# EAGLE design Joy2PS2_rev2 (EAGLE 7.6.0)
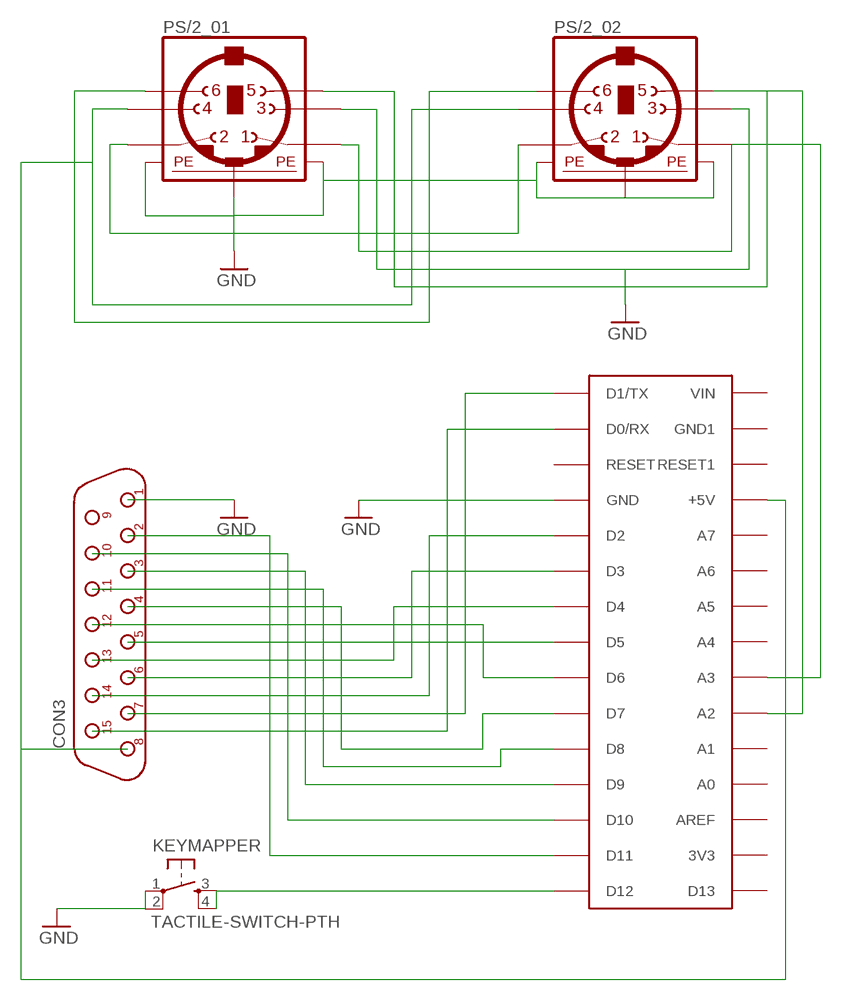
[diagram p0: schematic, sheet 1]

## Parts
ARDUINONANO  ARDUINONANO  [PDIP-32]
CON3  DB15M/90  [D-15M/90]
KEYMAPPER  TACTILE-SWITCH-PTH  [TAC-SWITCH-PTH]
PS/2_01  MINI_DIN_6  [M_DIN6]
PS/2_02  MINI_DIN_6  [M_DIN6]

## Nets
GND: ARDUINONANO.GND CON3.1 KEYMAPPER.1 KEYMAPPER.2 PS/2_01.3 PS/2_01.SH1(PE1) PS/2_01.SH2(PE2) PS/2_01.SH3(PE3) PS/2_02.3 PS/2_02.SH1(PE1) PS/2_02.SH2(PE2) PS/2_02.SH3(PE3)
N$1: ARDUINONANO.A3 PS/2_01.1 PS/2_02.1
N$2: PS/2_01.2 PS/2_02.2
N$3: ARDUINONANO.+5V CON3.8 PS/2_01.4 PS/2_02.4
N$5: ARDUINONANO.A2 PS/2_01.5 PS/2_02.5
N$6: ARDUINONANO.D10 CON3.10
N$7: ARDUINONANO.D8 CON3.11
N$8: ARDUINONANO.D0/RX CON3.15
N$9: ARDUINONANO.D1/TX CON3.7
N$10: ARDUINONANO.D2 CON3.14
N$11: ARDUINONANO.D3 CON3.6
N$12: ARDUINONANO.D4 CON3.13
N$13: ARDUINONANO.D5 CON3.5
N$14: ARDUINONANO.D6 CON3.12
N$15: ARDUINONANO.D7 CON3.4
N$16: ARDUINONANO.D9 CON3.3
N$17: ARDUINONANO.D11 CON3.2
N$19: ARDUINONANO.D12 KEYMAPPER.3 KEYMAPPER.4
N$20: PS/2_01.6 PS/2_02.6
Unconnected: ARDUINONANO.3V3 ARDUINONANO.A0 ARDUINONANO.A1 ARDUINONANO.A4 ARDUINONANO.A5 ARDUINONANO.A6 ARDUINONANO.A7 ARDUINONANO.AREF ARDUINONANO.D13 ARDUINONANO.GND1 ARDUINONANO.RESET ARDUINONANO.RESET1 ARDUINONANO.VIN CON3.9

## Library data of the parts
ARDUINONANO = jet-lib2:ARDUINONANO
CON3 = connect:DB15M/90
KEYMAPPER = GeekAmmo:TACTILE-SWITCH: Tactile Switch 4 Pins, SPST NO
PS/2_01 PS/2_02 = mini_din:MINI_DIN_6

## Board
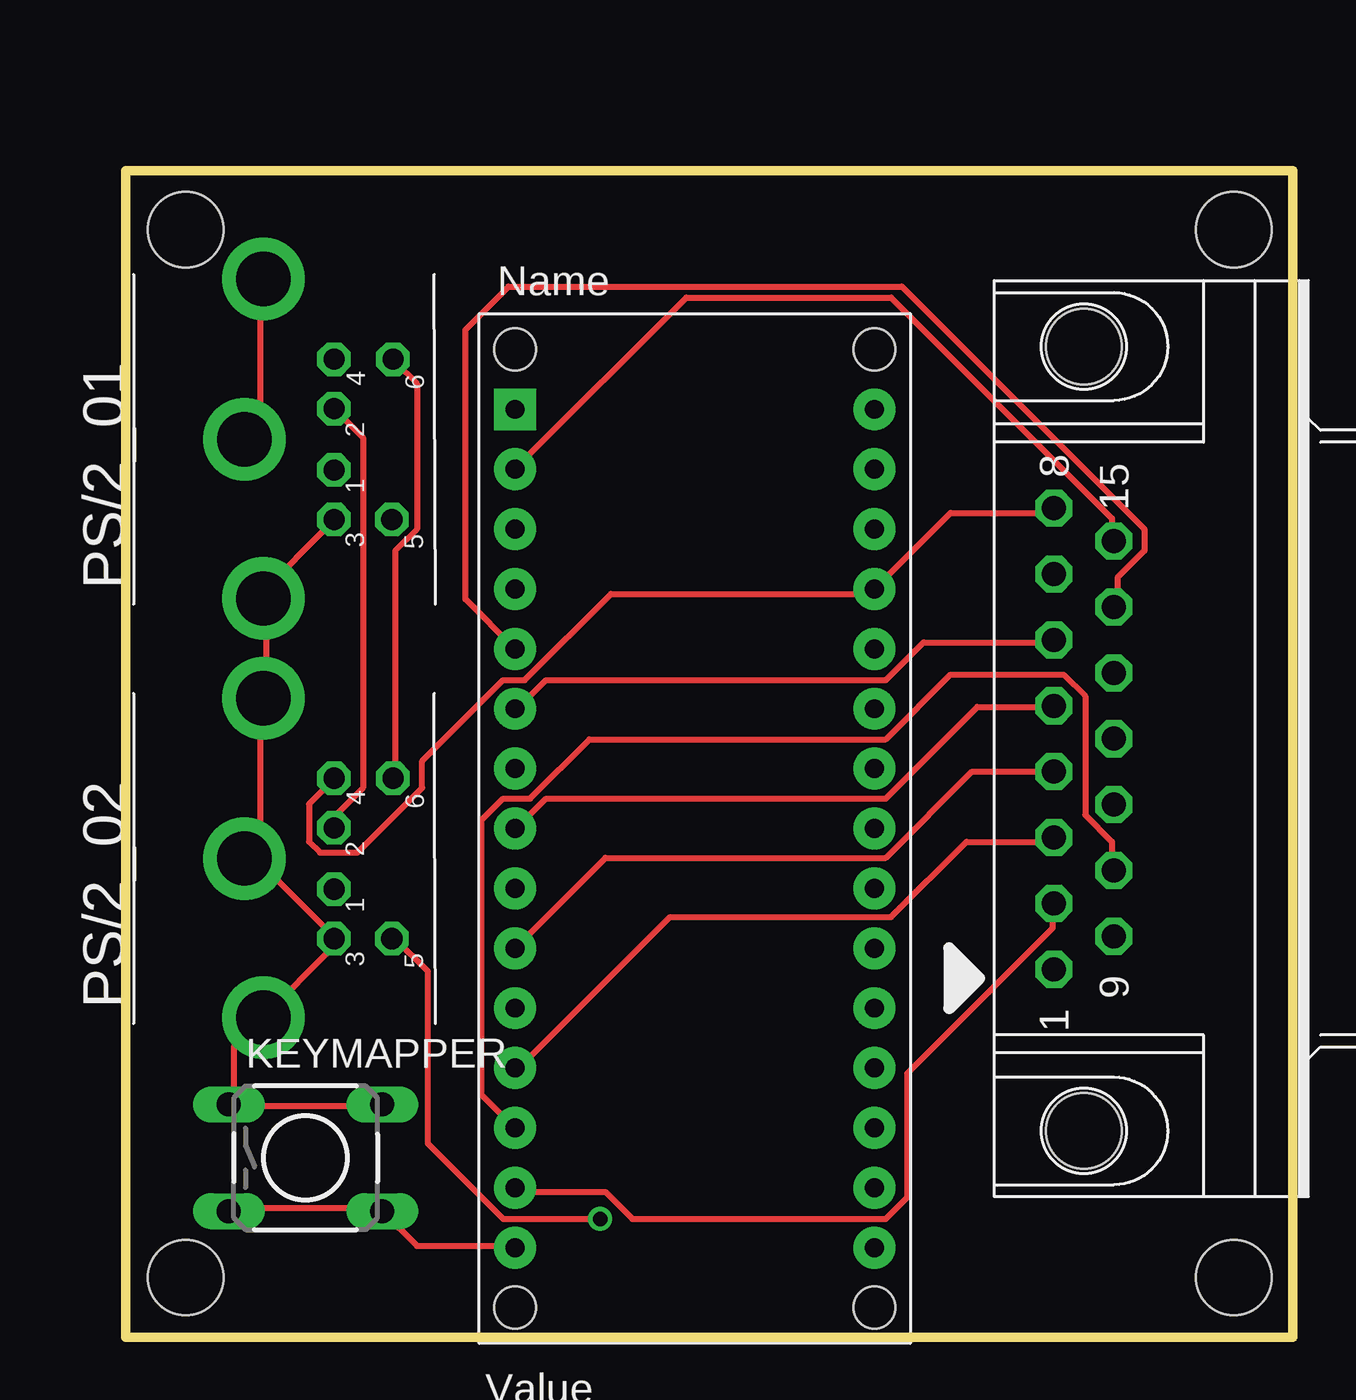
[diagram p1: board, top side]
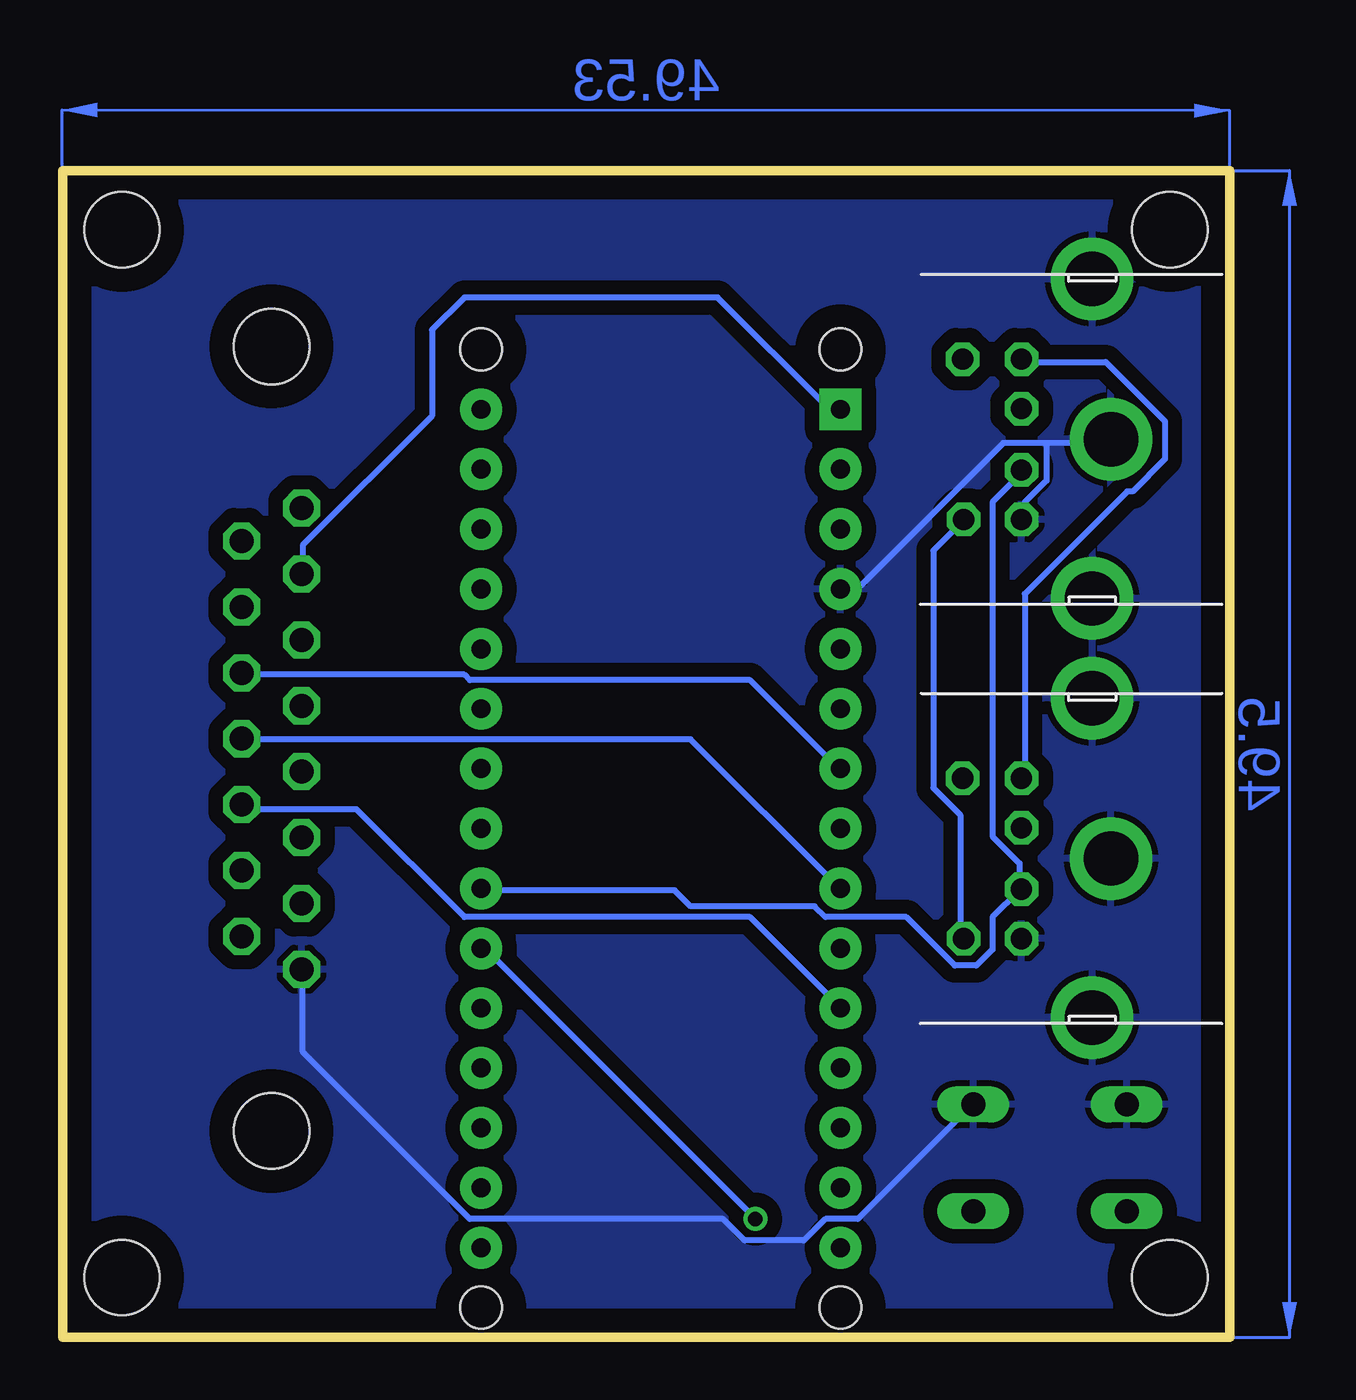
[diagram p2: board, bottom side, seen from below]

Size 49.5 x 49.5 mm. Coordinates in mm from the lower left corner, seen from the top.
Outline: 0,0 49.5,0 49.5,49.5 0,49.5 0,0
Copper layers (1*16): Top 0.035mm / dielectric 1.5mm / Bottom 0.035mm
Design rules "default": minimum track width 10mil, minimum drill 24mil, track to track 8mil, track to pad 8mil, pad to pad 8mil, via to via 8mil, smd to smd 8mil, copper to edge 40mil, drill to drill 8mil, minimum pad ring 10mil, minimum via ring 8mil, stop-mask expansion 4mil, vias tented up to drill 0mil, thermal gap 10mil
Holes 3.2 mm at 46.99,46.99 46.99,2.54 2.54,46.99 2.54,2.54

### Footprints (pad centres in the part's own frame; a part is rotated, then mirrored left to right if it is on the bottom)
PDIP-32 = drill 0.8 pad 1.778: 3V3 15.24,-35.56; +5V 15.24,-10.16; A0 15.24,-30.48; A1 15.24,-27.94; A2 15.24,-25.4; A3 15.24,-22.86; A4 15.24,-20.32; A5 15.24,-17.78; A6 15.24,-15.24; A7 15.24,-12.7; AREF 15.24,-33.02; D0/RX 0,-5.08; D2 0,-12.7; D3 0,-15.24; D4 0,-17.78; D5 0,-20.32; D6 0,-22.86; D7 0,-25.4; D8 0,-27.94; D9 0,-30.48; D10 0,-33.02; D11 0,-35.56; D12 0,-38.1; D13 15.24,-38.1; GND 0,-10.16; GND1 15.24,-5.08; RESET 0,-7.62; RESET1 15.24,-7.62; VIN 15.24,-2.54 | drill 0.8 pad 1.778 square: D1/TX 0,-2.54 | hole 1.778: 0,0; 0,-40.64; 15.24,-40.64; 15.24,0
D-15M/90 = drill 1.016 pad 1.575 octagon: 1 9.779,-1.27; 2 6.985,-1.27; 3 4.191,-1.27; 4 1.397,-1.27; 5 -1.397,-1.27; 6 -4.191,-1.27; 7 -6.985,-1.27; 8 -9.779,-1.27; 9 8.382,1.27; 10 5.588,1.27; 11 2.794,1.27; 12 0,1.27; 13 -2.794,1.27; 14 -5.588,1.27; 15 -8.382,1.27 | hole 3.2: 16.637,0; -16.637,0
TAC-SWITCH-PTH = drill 1.016 pad 1.524 long: 1 -3.251,2.261; 2 3.251,2.261; 3 -3.251,-2.261; 4 3.251,-2.261
M_DIN6 = drill 0.9 pad 1.422 octagon: 1 -1.3,-3.75; 2 1.3,-3.75; 3 -3.4,-3.75; 4 3.4,-3.75; 5 -3.4,-6.2; 6 3.4,-6.25 | drill 2.3 pad 3.5: SH1 6.8,-0.75; SH2 0,0.05; SH3 -6.75,-0.75

### Placement (x,y rotation side)
ARDUINONANO  16.51,41.91 0 top
CON3  40.64,25.4 270 top
KEYMAPPER  7.62,7.62 0 top
PS/2_01  5.08,38.1 90 top
PS/2_02  5.08,20.32 90 top

### Tracks (layer width: path | path; a pad name or v marks a point on that pad's centre or on a via)
GND
  Top 0.254: PS/2_01.3 8.69,34.52 5.71,31.55 PS/2_01.SH3 5.94,31.32 5.94,27.2 PS/2_02.SH1 5.71,26.98 5.71,20.12 | PS/2_01.SH1 5.71,44.81 5.71,38.63 5.26,38.18 PS/2_01.SH2 | KEYMAPPER.2 10.74,9.83 4.57,9.83 KEYMAPPER.1 4.57,10.06 4.57,12.34 5.71,13.49 PS/2_02.SH3 5.94,13.72 8.69,16.46 8.69,16.92 PS/2_02.3 8.69,17.14 5.71,20.12 | 5.71,20.12 5.26,20.12 PS/2_02.SH2 5.71,20.12
  Bottom 0.254: 7.77,37.95 5.26,37.95 PS/2_01.SH2 | 7.77,37.95 9.6,37.95 15.77,31.77 16.46,31.77 ARDUINONANO.GND | 7.77,37.95 7.77,36.35 8.69,35.43 8.69,34.75 PS/2_01.3 | CON3.1 39.32,15.54 39.32,12.12 32.23,5.03 21.49,5.03 20.57,4.12 18.06,4.12 17.14,5.03 15.77,5.03 10.97,9.83 KEYMAPPER.2
  pour Bottom (isolate 0.61): 0,49.53 49.53,49.53 49.53,0 0,0
N$1
  Bottom 0.254: PS/2_01.1 8.91,36.58 10.06,35.43 10.06,21.26 8.91,20.12 8.91,19.2 PS/2_02.1 8.91,18.97 10.06,17.83 10.06,16.46 10.74,15.77 11.66,15.77 13.72,17.83 17.14,17.83 17.6,18.29 22.86,18.29 23.55,18.97 31.55,18.97 ARDUINONANO.A3
N$2
  Top 0.254: PS/2_02.2 8.91,21.72 8.91,22.17 10.06,23.32 10.06,38.18 8.91,39.32 PS/2_01.2
N$3
  Top 0.254: CON3.8 39.32,34.98 34.98,34.98 ARDUINONANO.+5V 31.55,31.55 20.57,31.55 16.92,27.89 16,27.89 12.57,24.46 12.57,23.32 9.83,20.57 8.23,20.57 7.77,21.03 7.77,22.63 8.69,23.55 PS/2_02.4
  Bottom 0.254: PS/2_02.4 8.69,23.77 8.69,31.55 4.34,35.89 4.12,35.89 2.74,37.26 2.74,38.86 5.26,41.38 8.69,41.38 PS/2_01.4
N$5  (via drill 0.61)
  Top 0.254: v20.12,5.03 16,5.03 12.8,8.23 12.8,15.54 11.43,16.92 PS/2_02.5
  Bottom 0.254: PS/2_02.5 11.43,17.14 11.43,22.17 12.57,23.32 12.57,33.38 11.43,34.52 PS/2_01.5 | v20.12,5.03 31.55,16.46 ARDUINONANO.A2
N$6
  Top 0.254: CON3.10 41.83,19.89 41.83,21.03 40.69,22.17 40.69,27.2 39.78,28.12 34.98,28.12 32.23,25.38 19.66,25.38 17.14,22.86 16,22.86 15.09,21.95 15.09,10.29 16.46,8.91 ARDUINONANO.D10
N$7
  Bottom 0.254: CON3.11 41.83,22.4 37.03,22.4 32.46,17.83 20.34,17.83 16.69,14.17 ARDUINONANO.D8
N$8
  Top 0.254: CON3.15 41.83,33.83 41.83,34.75 32.46,44.12 23.77,44.12 16.69,37.03 ARDUINONANO.D0/RX
N$9
  Bottom 0.254: CON3.7 39.32,32.46 39.32,33.6 33.83,39.09 33.83,42.75 32.46,44.12 21.72,44.12 17.14,39.55 16.69,39.55 ARDUINONANO.D1/TX
N$10
  Top 0.254: ARDUINONANO.D2 14.4,31.32 14.4,42.75 16.23,44.58 32.92,44.58 43.2,34.29 43.2,33.38 42.06,32.23 42.06,31.09 CON3.14
N$11
  Top 0.254: CON3.6 39.32,29.49 33.83,29.49 32.23,27.89 17.83,27.89 16.69,26.75 ARDUINONANO.D3
N$12
  Bottom 0.254: CON3.13 41.83,28.12 32.46,28.12 32.23,27.89 20.34,27.89 16.69,24.23 ARDUINONANO.D4
N$13
  Top 0.254: CON3.5 39.32,26.75 36.12,26.75 32.23,22.86 17.83,22.86 16.69,21.72 ARDUINONANO.D5
N$14
  Bottom 0.254: CON3.12 41.83,25.38 22.86,25.38 16.69,19.2 ARDUINONANO.D6
N$15
  Top 0.254: CON3.4 35.89,24 32.23,20.34 20.34,20.34 ARDUINONANO.D7
N$16
  Top 0.254: CON3.3 39.32,21.03 35.66,21.03 32.46,17.83 23.09,17.83 16.69,11.43 ARDUINONANO.D9
N$17
  Top 0.254: CON3.2 39.32,18.29 39.32,17.37 33.15,11.2 33.15,5.94 32.23,5.03 21.49,5.03 20.34,6.17 16.69,6.17 ARDUINONANO.D11
N$19
  Top 0.254: KEYMAPPER.3 4.57,5.49 10.74,5.49 KEYMAPPER.4 12.34,3.89 16.46,3.89 ARDUINONANO.D12
N$20
  Top 0.254: PS/2_02.6 11.43,23.77 11.43,33.38 12.34,34.29 12.34,40.46 11.43,41.38 PS/2_01.6
(copper drawn outside any net)
  shapes: Bottom area x2